# Altium schematic sheet 105358-3SC002-01-A_BlockDiagram.SchDoc: Block Diagram
size 420 x 297 mm; DrawnBy: JeSa , KaKa; Organization: Hotswap Norden AB; Address1: Knarrarnäsgatan 7; Address2: SE-164 40 Kista; Address3: Sweden; DocumentNumber: 105358-3SC001-01; SheetNumber: 2; SheetTotal: 5; PageSetup: Record=PageOptions|CenterHorizontal=True|CenterVertical=True|PrintScale=0.96|XCorrection=1.00|YCorrection=1.00|PrintKind=0|BorderSize=5000000|LeftOffset=0|BottomOffset=0|Orientation=2|PaperLength=1000|PaperWidth=1000|Scale=100|PaperSource=7|PrintQuality=-4|MediaType=1|DitherType=10|PaperKind=A3|PrintScaleMode=1
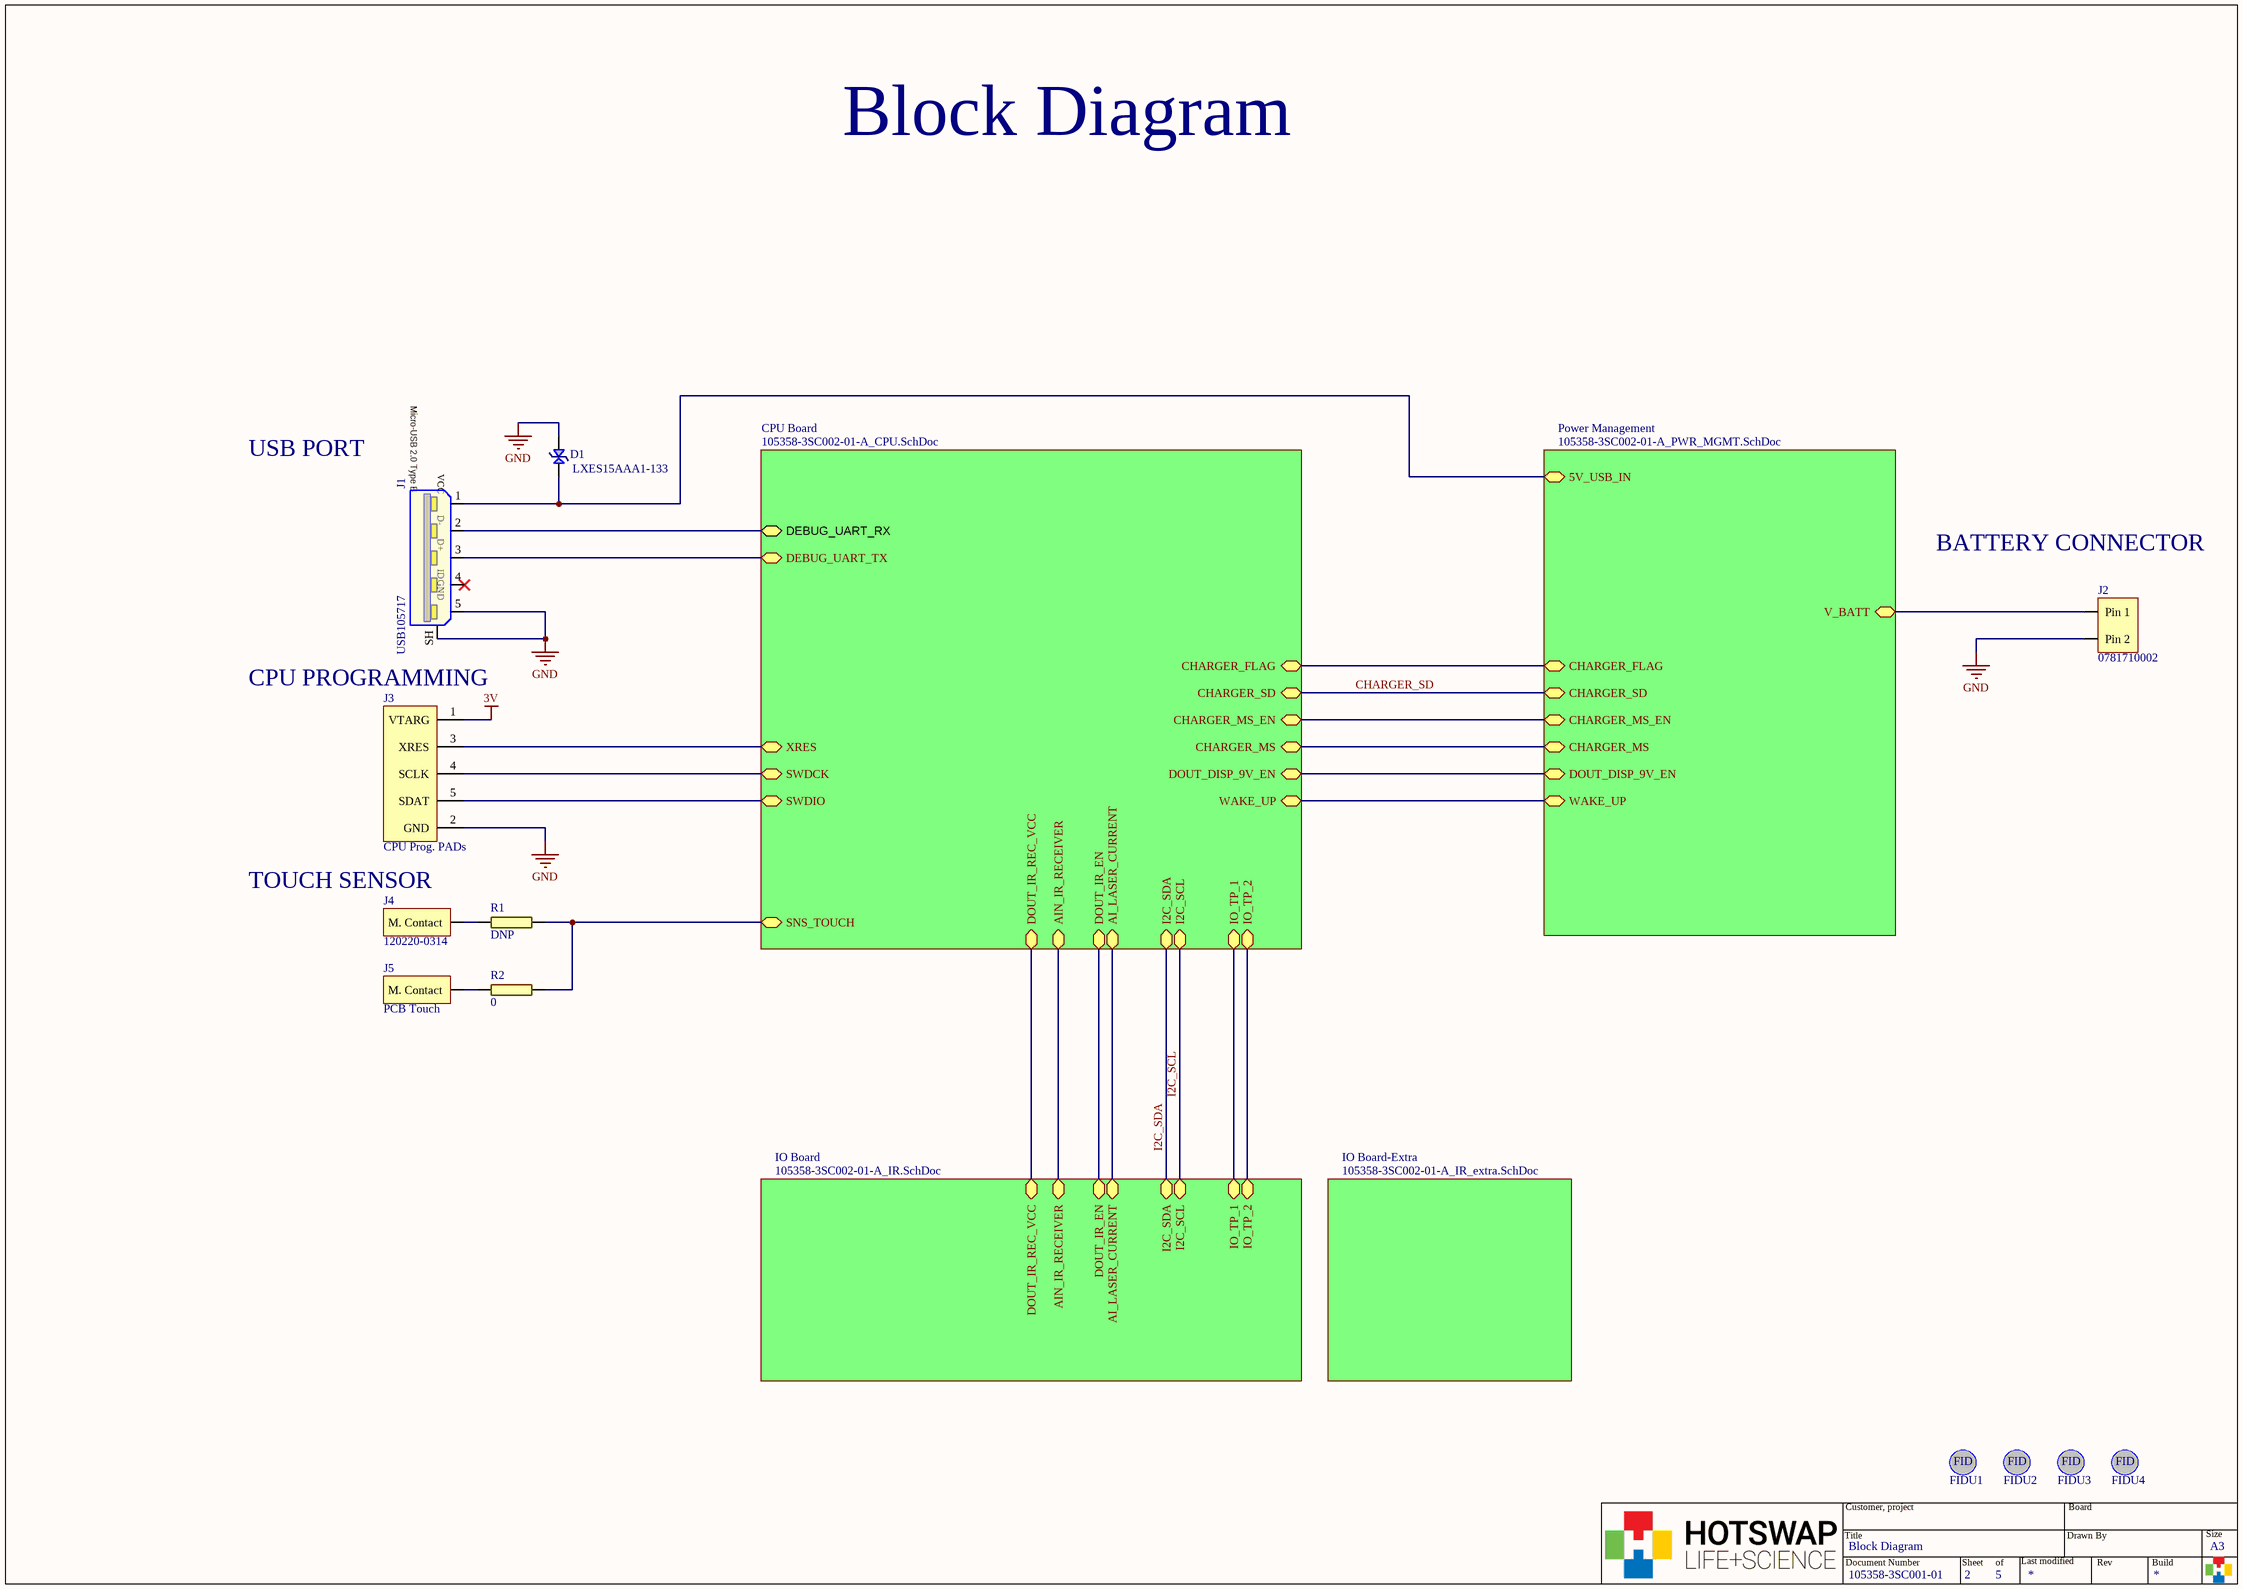
[diagram p0: 105358-3SC002-01-A_BlockDiagram.SchDoc]

## Parts
D1  LXES15AAA1-133  [0402C-GENERIC]
FIDU1  FIDU-miniROUND  [FIDU-MINI-ROUND]  (value not drawn)  (no BOM)
FIDU2  FIDU-miniROUND  [FIDU-MINI-ROUND]  (value not drawn)  (no BOM)
FIDU3  FIDU-miniROUND  [FIDU-MINI-ROUND]  (value not drawn)  (no BOM)
FIDU4  FIDU-miniROUND  [FIDU-MINI-ROUND]  (value not drawn)  (no BOM)
J1  USB105717  [UUSB_MOLEX105017]
J2  0781710002  [PAD 0781710002]
J3  CPU Prog. PADs  [PAD PROGRAMMING]  (no BOM)
J4  120220-0314  [PAD 1.0x1.95mm]
J5  PCB Touch  [Touch_PAD]
R1  DNP  [0402R-GENERIC]
R2  0  [0402R-GENERIC]

## Sub-sheets
CPU Board = 105358-3SC002-01-A_CPU.SchDoc: DEBUG_UART_TX, CHARGER_FLAG, CHARGER_MS, CHARGER_SD, CHARGER_MS_EN, WAKE_UP, DOUT_DISP_9V_EN, XRES, SWDCK, SWDIO, AIN_IR_RECEIVER, I2C_SDA, I2C_SCL, IO_TP_1, IO_TP_2, SNS_TOUCH, AI_LASER_CURRENT, DOUT_IR_REC_VCC, DOUT_IR_EN, DEBUG_UART_RX
IO Board = 105358-3SC002-01-A_IR.SchDoc: AIN_IR_RECEIVER, I2C_SDA, I2C_SCL, IO_TP_1, IO_TP_2, AI_LASER_CURRENT, DOUT_IR_REC_VCC, DOUT_IR_EN
IO Board-Extra = 105358-3SC002-01-A_IR_extra.SchDoc: no entries
Power Management = 105358-3SC002-01-A_PWR_MGMT.SchDoc: CHARGER_FLAG, CHARGER_MS_EN, CHARGER_SD, CHARGER_MS, WAKE_UP, DOUT_DISP_9V_EN, 5V_USB_IN, V_BATT

## Nets
3V: J3.1(VTARG)
GND: D1.1 J1.5(GND) J1.SH(Shell) J2.2(Pin_2) J3.2(GND)
CHARGER_SD: sheet Power Management/CHARGER_SD, sheet CPU Board/CHARGER_SD
I2C_SCL: sheet CPU Board/I2C_SCL, sheet IO Board/I2C_SCL
I2C_SDA: sheet CPU Board/I2C_SDA, sheet IO Board/I2C_SDA
NetD1_2: D1.2 J1.1(VCC) ; sheet Power Management/5V_USB_IN
NetJ1_2: J1.2(D-) ; sheet CPU Board/DEBUG_UART_RX
NetJ1_3: J1.3(D+) ; sheet CPU Board/DEBUG_UART_TX
NetJ2_1: J2.1(Pin_1) ; sheet Power Management/V_BATT
NetJ3_3: J3.3(XRES) ; sheet CPU Board/XRES
NetJ3_4: J3.4(SCLK) ; sheet CPU Board/SWDCK
NetJ3_5: J3.5(SDAT) ; sheet CPU Board/SWDIO
NetJ4_1: J4.1(M._Contact) R1.1
NetJ5_1: J5.1(M._Contact) R2.1
NetR1_2: R1.2 R2.2 ; sheet CPU Board/SNS_TOUCH
(unnamed): sheet Power Management/CHARGER_FLAG, sheet CPU Board/CHARGER_FLAG
(unnamed): sheet Power Management/CHARGER_MS_EN, sheet CPU Board/CHARGER_MS_EN
(unnamed): sheet Power Management/CHARGER_MS, sheet CPU Board/CHARGER_MS
(unnamed): sheet Power Management/WAKE_UP, sheet CPU Board/WAKE_UP
(unnamed): sheet Power Management/DOUT_DISP_9V_EN, sheet CPU Board/DOUT_DISP_9V_EN
(unnamed): sheet CPU Board/AIN_IR_RECEIVER, sheet IO Board/AIN_IR_RECEIVER
(unnamed): sheet CPU Board/IO_TP_1, sheet IO Board/IO_TP_1
(unnamed): sheet CPU Board/IO_TP_2, sheet IO Board/IO_TP_2
(unnamed): sheet CPU Board/AI_LASER_CURRENT, sheet IO Board/AI_LASER_CURRENT
(unnamed): sheet CPU Board/DOUT_IR_REC_VCC, sheet IO Board/DOUT_IR_REC_VCC
(unnamed): sheet CPU Board/DOUT_IR_EN, sheet IO Board/DOUT_IR_EN

Not connected (* = marked no-connect by the designer): J1 4(ID)*

## Notes on the sheet
- Block Diagram
- USB PORT
- BATTERY CONNECTOR
- CPU PROGRAMMING
- TOUCH SENSOR
- Title
- Customer, project
- Drawn By
- Board
- Size
- Document Number
- Sheet
- of
- Last modified
- Rev
- Build
- A3
- (in symbol FIDU-miniROUND) FID
- (in symbol USB105717) Micro-USB 2.0 Type B

## Library data of the parts
D1 = TVS DIODE 15VWM 0402: Manufacturer: Murata Electronics North America; Type: Zener; Capacitance @ Frequency: 0.05pF @ 1MHz; Voltage - Reverse Standoff (Typ): 15V; Manufacturer Part Number: LXES15AAA1-133; Digi-Key Part Number: 490-13209-1-ND; PackageReference: 0402
J1 = USB105717: CONN RCPT USB-micro; Manufacturer: Molex; Manufacturer Part Number: 105017
J2 = CONNECTOR 1.20MM WTB HEADER VERT 2POS: 1.20MM WTB HEADER VERT 2POS; Manufacturer: Molex, LLC; ComponentLink1URL: http://www.molex.com/pdm_docs/sd/781710002_sd.pdf; ComponentLink1Description: Datasheet; Manufacturer Part Number: 0781710002; Mounting Type: Surface Mount; Digi-Key Part Number: WM4459CT-ND
J3 = PROGRAMMING PADS: CPU Programming PADs
J4 = MICRO UNIVERSAL CONTACT Z 3.5MM: Manufacturer: ITT Cannon, LLC; ComponentLink1URL: https://media.digikey.com/pdf/Data%20Sheets/ITT%20PDFs/120220-0314_Dwg.pdf; ComponentLink1Description: Datasheet; Manufacturer Part Number: 120220-0314; Mounting Type: Surface Mount; Digi-Key Part Number: 1003-2383-1-ND
J5 = PCB Touch: PCB Touch PAD
R1 = 0402R-Do Not Place
R2 = 0402R-0 OHM-0.063W: RES SMD 0.0OHM JUMPER 1/16W 0402; Manufacturer: Yageo; Manufacturer Part Number: RC0402JR-070RL; Resistance (Ohms): 0 Ohm; Power: 0.063W; GENERIC_OK: YES; Digi-Key Part Number: 311-0.0JRCT-ND; PackageReference: 0402; Features: Moisture Resistant
FIDU1-FIDU4 = FIDU-miniROUND: ClassName: FIDU